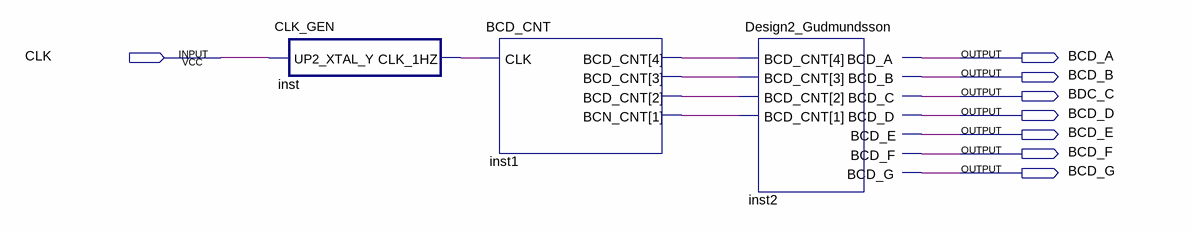
[diagram p0: schematic sheet]
// Quartus schematic Design3_Block_Gudmundsson.bdf as structural Verilog: 3 symbols, 8 pins
module Design3_Block_Gudmundsson (
  input  CLK,
  output BCD_A,
  output BCD_B,
  output BDC_C,
  output BCD_D,
  output BCD_E,
  output BCD_F,
  output BCD_G
);

  wire inst1_bcd_cnt, inst1_bcd_cnt_2, inst1_bcd_cnt_3, inst1_bcn_cnt, inst_clk_1hz;

  CLK_GEN inst (.UP2_XTAL_Y(CLK), .CLK_1HZ(inst_clk_1hz));
  BCD_CNT inst1 (
    .CLK(inst_clk_1hz), .BCD_CNT({inst1_bcd_cnt, inst1_bcd_cnt_2, inst1_bcd_cnt_3}), .BCN_CNT(inst1_bcn_cnt));
  Design2_Gudmundsson inst2 (
    .BCD_CNT({inst1_bcd_cnt, inst1_bcd_cnt_2, inst1_bcd_cnt_3, inst1_bcn_cnt}), .BCD_A(BCD_A), .BCD_B(BCD_B),
    .BCD_C(BDC_C), .BCD_D(BCD_D), .BCD_E(BCD_E), .BCD_F(BCD_F), .BCD_G(BCD_G));
endmodule
